# Altium schematic sheet TB-01_V1.0.SchDoc
size A4
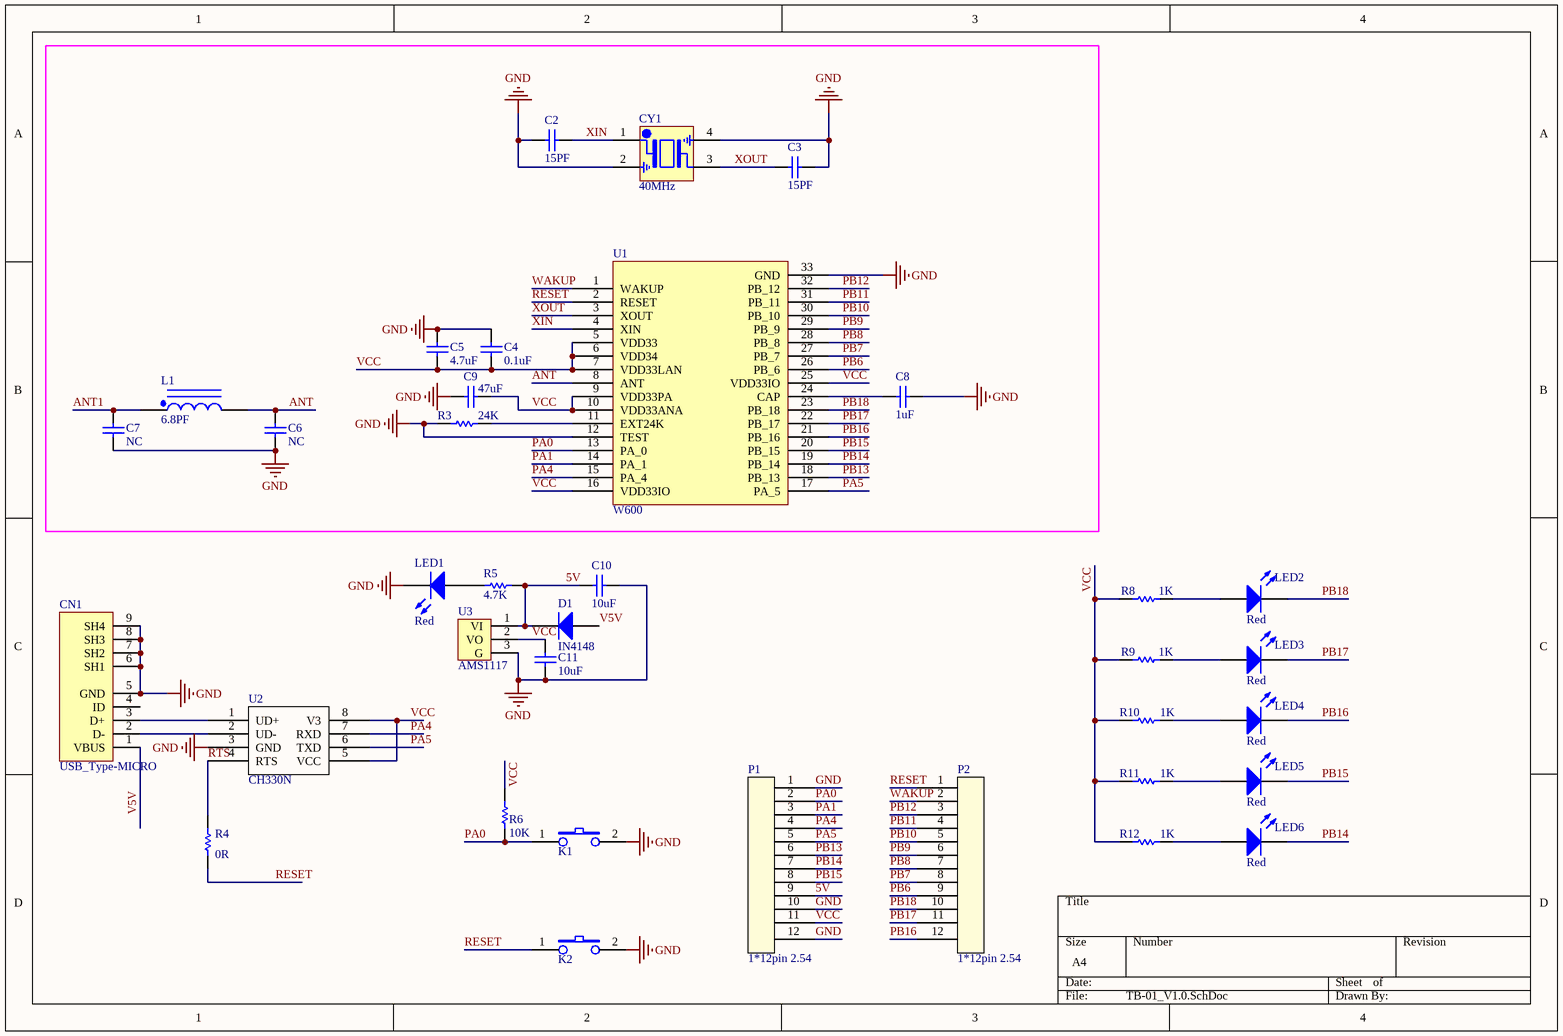
[diagram p0: TB-01_V1.0.SchDoc]

## Parts
C2  15PF  [0402C]
C3  15PF  [0402C]
C4  0.1uF  [0402C]
C5  4.7uF  [0603C]
C6  NC  [0402C]
C7  NC  [0402C]
C8  1uF  [0402C]
C9  47uF  [0805C]
C10  10uF  [0603C]
C11  10uF  [0603C]
CN1  USB_Type-MICRO  [MICRO_USB_DIPB]
CY1  40MHz  [CY3225]
D1  IN4148  [1n5819]
K1  Button  [BUTTON3*4*2]  (value not drawn)
K2  Button  [BUTTON3*4*2]  (value not drawn)
L1  6.8PF  [0402L]
LED1  Red  [0603LED]
LED2  Red  [0603LED]
LED3  Red  [0603LED]
LED4  Red  [0603LED]
LED5  Red  [0603LED]
LED6  Red  [0603LED]
P1  1*12pin 2.54  [1*12PIN 2.54]
P2  1*12pin 2.54  [1*12PIN 2.54]
R3  24K  [0402R]
R4  0R  [0402R]
R5  4.7K  [0402R]
R6  10K  [0402R]
R8  1K  [0402R]
R9  1K  [0402R]
R10  1K  [0402R]
R11  1K  [0402R]
R12  1K  [0402R]
U1  W600  [W600]
U2  CH330N  [CH330N]
U3  AMS1117  [AMS1117]

## Nets
GND: C2.1 C3.2 C4.2 C5.2 C6.1 C7.1 C8.2 C9.1 C10.1 C11.2 CN1.5(GND) CN1.6(SH1) CN1.7(SH2) CN1.8(SH3) CN1.9(SH4) CY1.2(GND) CY1.4(GND) K1.2(B0) K2.2(B0) LED1.2(K) P1.1 P1.10 P1.12 R3.1 U1.12(TEST) U1.33(GND) U2.3(GND) U3.3(G)
5V: C10.2 D1.2(K) P1.9 R5.2 U3.1(VI)
ANT: C6.2 L1.2 U1.8(ANT)
ANT1: C7.2 L1.1
PA0: K1.1(A0) P1.2 R6.1 U1.13(PA_0)
PA1: P1.3 U1.14(PA_1)
PA4: P1.4 U1.15(PA_4) U2.7(RXD)
PA5: P1.5 U1.17(PA_5) U2.6(TXD)
PB6: P2.9 U1.26(PB_6)
PB7: P2.8 U1.27(PB_7)
PB8: P2.7 U1.28(PB_8)
PB9: P2.6 U1.29(PB_9)
PB10: P2.5 U1.30(PB_10)
PB11: P2.4 U1.31(PB_11)
PB12: P2.3 U1.32(PB_12)
PB13: P1.6 U1.18(PB_13)
PB14: LED6.2(K) P1.7 U1.19(PB_14)
PB15: LED5.2(K) P1.8 U1.20(PB_15)
PB16: LED4.2(K) P2.12 U1.21(PB_16)
PB17: LED3.2(K) P2.11 U1.22(PB_17)
PB18: LED2.2(K) P2.10 U1.23(PB_18)
RESET: K2.1(A0) P2.1 R4.1 U1.2(RESET)
RTS: R4.2 U2.4(RTS)
V5V: CN1.1(VBUS) D1.1(A)
VCC: C4.1 C5.1 C9.2 C11.1 P1.11 R6.2 R8.2 R9.2 R10.2 R11.2 R12.2 U1.5(VDD33) U1.6(VDD34) U1.7(VDD33LAN) U1.9(VDD33PA) U1.10(VDD33ANA) U1.16(VDD33IO) U1.25(VDD33IO) U2.5(VCC) U2.8(V3) U3.2(VO)
WAKUP: P2.2 U1.1(WAKUP)
XIN: C2.2 CY1.1(IN/OUT) U1.4(XIN)
XOUT: C3.1 CY1.3(IN/OUT) U1.3(XOUT)
NetC8_1: C8.1 U1.24(CAP)
NetCN1_2: CN1.2(D-) U2.2(UD-)
NetCN1_3: CN1.3(D+) U2.1(UD+)
NetLED1_1: LED1.1(A) R5.1
NetLED2_1: LED2.1(A) R8.1
NetLED3_1: LED3.1(A) R9.1
NetLED4_1: LED4.1(A) R10.1
NetLED5_1: LED5.1(A) R11.1
NetLED6_1: LED6.1(A) R12.1
NetR3_2: R3.2 U1.11(EXT24K)

Not connected (* = marked no-connect by the designer): CN1 4(ID)

## Library data of the parts
C2-C11 = CAP
CY1 = CY3225
L1 = L
LED1-LED6 = LED
R3-R6 R8-R12 = RES